# EAGLE design BBRF103-RC3 (EAGLE 8.4.3)
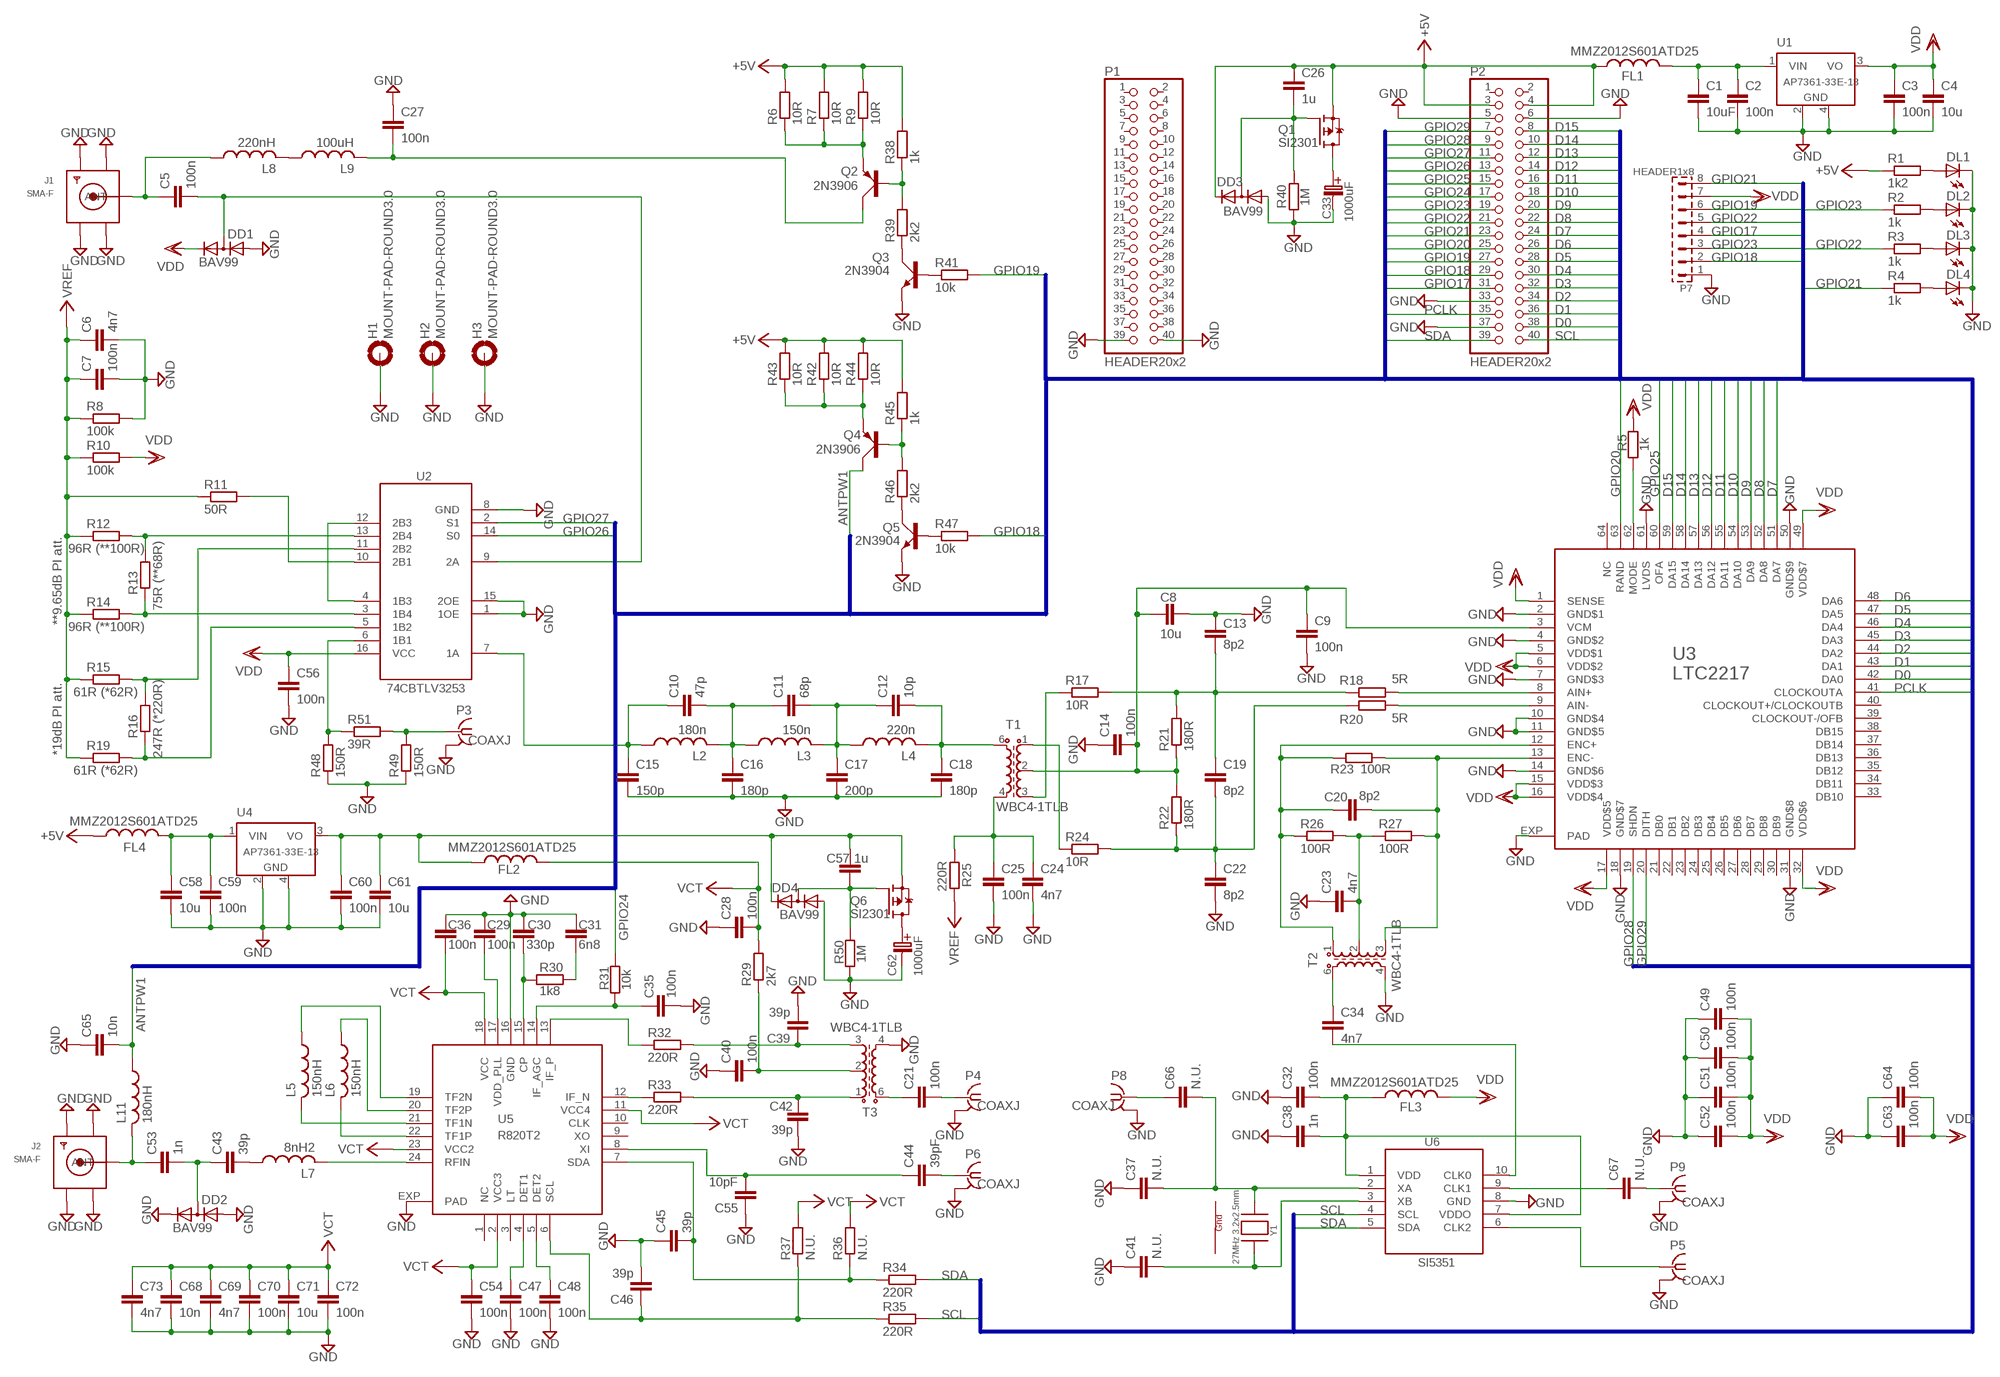
[diagram p0: schematic, sheet 1]

## Parts
C1  10uF  C-EUC0805K  [C0805K]
C2  100n  C-EUC0603K  [C0603K]
C3  100n  C-EUC0603K  [C0603K]
C4  10u  C-EUC0805K  [C0805K]
C5  100n  C-EUC0603K  [C0603K]
C6  4n7  C-EUC0603K  [C0603K]
C7  100n  C-EUC0603K  [C0603K]
C8  10u  C-EUC0603K  [C0603K]
C9  100n  C-EUC0603K  [C0603K]
C10  47p  C-EUC0603K  [C0603K]
C11  68p  C-EUC0603K  [C0603K]
C12  10p  C-EUC0603K  [C0603K]
C13  8p2  C-EUC0603K  [C0603K]
C14  100n  C-EUC0603K  [C0603K]
C15  150p  C-EUC0603K  [C0603K]
C16  180p  C-EUC0603K  [C0603K]
C17  200p  C-EUC0603K  [C0603K]
C18  180p  C-EUC0603K  [C0603K]
C19  8p2  C-EUC0603K  [C0603K]
C20  8p2  C-EUC0603K  [C0603K]
C21  100n  C-EUC0603K  [C0603K]
C22  8p2  C-EUC0603K  [C0603K]
C23  4n7  C-EUC0603K  [C0603K]
C24  4n7  C-EUC0603K  [C0603K]
C25  100n  C-EUC0603K  [C0603K]
C26  1u  C-EUC0603K  [C0603K]
C27  100n  C-EUC0603K  [C0603K]
C28  100n  C-EUC0603K  [C0603K]
C29  100n  C-EUC0603K  [C0603K]
C30  330p  C-EUC0603K  [C0603K]
C31  6n8  C-EUC0603K  [C0603K]
C32  100n  C-EUC0603K  [C0603K]
C33  1000uF  #_RADIAL_POUZDRA5  [C_EL_5]
C34  4n7  C-EUC0603K  [C0603K]
C35  100n  C-EUC0603K  [C0603K]
C36  100n  C-EUC0603K  [C0603K]
C37  N.U.  C-EUC0603K  [C0603K]
C38  1n  C-EUC0603K  [C0603K]
C39  39p  C-EUC0603K  [C0603K]
C40  100n  C-EUC0603K  [C0603K]
C41  N.U.  C-EUC0603K  [C0603K]
C42  39p  C-EUC0603K  [C0603K]
C43  39p  C-EUC0603K  [C0603K]
C44  39pF  C-EUC0603K  [C0603K]
C45  39p  C-EUC0603K  [C0603K]
C46  39p  C-EUC0603K  [C0603K]
C47  100n  C-EUC0603K  [C0603K]
C48  100n  C-EUC0603K  [C0603K]
C49  100n  C-EUC0603K  [C0603K]
C50  100n  C-EUC0603K  [C0603K]
C51  100n  C-EUC0603K  [C0603K]
C52  100n  C-EUC0603K  [C0603K]
C53  1n  C-EUC0603K  [C0603K]
C54  100n  C-EUC0603K  [C0603K]
C55  10pF  C-EUC0603K  [C0603K]
C56  100n  C-EUC0603K  [C0603K]
C57  1u  C-EUC0603K  [C0603K]
C58  10u  C-EUC0805K  [C0805K]
C59  100n  C-EUC0603K  [C0603K]
C60  100n  C-EUC0603K  [C0603K]
C61  10u  C-EUC0805K  [C0805K]
C62  1000uF  #_RADIAL_POUZDRA5  [C_EL_5]
C63  100n  C-EUC0603K  [C0603K]
C64  100n  C-EUC0603K  [C0603K]
C65  10n  C-EUC0603K  [C0603K]
C66  N.U.  C-EUC0603K  [C0603K]
C67  N.U.  C-EUC0603K  [C0603K]
C68  10n  C-EUC0603K  [C0603K]
C69  4n7  C-EUC0603K  [C0603K]
C70  100n  C-EUC0603K  [C0603K]
C71  10u  C-EUC0805K  [C0805K]
C72  100n  C-EUC0603K  [C0603K]
C73  4n7  C-EUC0603K  [C0603K]
DD1  BAV99  BAV199  [SOT23]
DD2  BAV99  BAV199  [SOT23]
DD3  BAV99  BAV199  [SOT23]
DD4  BAV99  BAV199  [SOT23]
DL1  LEDCHIPLED_0805  [CHIPLED_0805]
DL2  LEDCHIPLED_0805  [CHIPLED_0805]
DL3  LEDCHIPLED_0805  [CHIPLED_0805]
DL4  LEDCHIPLED_0805  [CHIPLED_0805]
FL1  MMZ2012S601ATD25  L-USL2012C  [L2012C]
FL2  MMZ2012S601ATD25  L-USL2012C  [L2012C]
FL3  MMZ2012S601ATD25  L-USL2012C  [L2012C]
FL4  MMZ2012S601ATD25  L-USL2012C  [L2012C]
H1  MOUNT-PAD-ROUND3.0  [3,0-PAD]
H2  MOUNT-PAD-ROUND3.0  [3,0-PAD]
H3  MOUNT-PAD-ROUND3.0  [3,0-PAD]
J1  SMA-F  SMACONNECTOR_EDGE  [SMA_EDGELAUNCH]
J2  SMA-F  SMACONNECTOR_EDGE  [SMA_EDGELAUNCH]
L2  180n  L-USL2012C  [L2012C]
L3  150n  L-USL2012C  [L2012C]
L4  220n  L-USL2012C  [L2012C]
L5  150nH  L-0603  [C0603K]
L6  150nH  L-0603  [C0603K]
L7  8nH2  L-0603  [C0603K]
L8  220nH  L-USL2012C  [L2012C]
L9  100uH  L-USL2012C  [L2012C]
L11  180nH  L-0603  [C0603K]
P1  HEADER20x2  PINHD-2X20  [2X20]
P2  HEADER20x2  PINHD-2X20  [2X20]
P3  COAXJ  [COAXJ]
P4  COAXJ  [COAXJ]
P5  COAXJ  [COAXJ]
P6  COAXJ  [COAXJ]
P7  HEADER1x8  S1G8_JUMP  [S1G8_JUM]
P8  COAXJ  [COAXJ]
P9  COAXJ  [COAXJ]
Q1  SI2301  [SOT23]
Q2  2N3906  [SOT23W_INFINEON]
Q3  2N3904  [SOT23W_INFINEON]
Q4  2N3906  [SOT23W_INFINEON]
Q5  2N3904  [SOT23W_INFINEON]
Q6  SI2301  [SOT23]
R1  1k2  R-EU_R0603  [R0603]
R2  1k  R-EU_R0603  [R0603]
R3  1k  R-EU_R0603  [R0603]
R4  1k  R-EU_R0603  [R0603]
R5  1k  R-EU_R0603  [R0603]
R6  10R  R-EU_R0603  [R0603]
R7  10R  R-EU_R0603  [R0603]
R8  100k  R-EU_R0603  [R0603]
R9  10R  R-EU_R0603  [R0603]
R10  100k  R-EU_R0603  [R0603]
R11  50R  R-EU_R0603  [R0603]
R12  96R (**100R)  R-EU_R0603  [R0603]
R13  75R (**68R)  R-EU_R0603  [R0603]
R14  96R (**100R)  R-EU_R0603  [R0603]
R15  61R (*62R)  R-EU_R0603  [R0603]
R16  247R (*220R)  R-EU_R0603  [R0603]
R17  10R  R-EU_R0603  [R0603]
R18  5R  R-EU_R0603  [R0603]
R19  61R (*62R)  R-EU_R0603  [R0603]
R20  5R  R-EU_R0603  [R0603]
R21  180R  R-EU_R0603  [R0603]
R22  180R  R-EU_R0603  [R0603]
R23  100R  R-EU_R0603  [R0603]
R24  10R  R-EU_R0603  [R0603]
R25  220R  R-EU_R0603  [R0603]
R26  100R  R-EU_R0603  [R0603]
R27  100R  R-EU_R0603  [R0603]
R29  2k7  R-EU_R0603  [R0603]
R30  1k8  R-EU_R0603  [R0603]
R31  10k  R-EU_R0603  [R0603]
R32  220R  R-EU_R0603  [R0603]
R33  220R  R-EU_R0603  [R0603]
R34  220R  R-EU_R0603  [R0603]
R35  220R  R-EU_R0603  [R0603]
R36  N.U.  R-EU_R0603  [R0603]
R37  N.U.  R-EU_R0603  [R0603]
R38  1k  R-EU_R0603  [R0603]
R39  2k2  R-EU_R0603  [R0603]
R40  1M  R-EU_R0603  [R0603]
R41  10k  R-EU_R0603  [R0603]
R42  10R  R-EU_R0603  [R0603]
R43  10R  R-EU_R0603  [R0603]
R44  10R  R-EU_R0603  [R0603]
R45  1k  R-EU_R0603  [R0603]
R46  2k2  R-EU_R0603  [R0603]
R47  10k  R-EU_R0603  [R0603]
R48  150R  R-EU_R0603  [R0603]
R49  150R  R-EU_R0603  [R0603]
R50  1M  R-EU_R0603  [R0603]
R51  39R  R-EU_R0603  [R0603]
T1  WBC4-1TLB  WBC4-1WL  [WBC4-1WL]
T2  WBC4-1TLB  WBC4-1WL  [WBC4-1WL]
T3  WBC4-1TLB  WBC4-1WL  [WBC4-1WL]
U1  AP7361-33E-13  [SOT223]
U2  74CBTLV3253  [TSSOP16]
U3  LTC2217  [QFN64-9X9]
U4  AP7361-33E-13  [SOT223]
U5  R820T2  R820T  [QFN24]
U6  SI5351  [MSOP10]
Y1  27MHz 3.2x2.5mm  XTAL-4-3225  [NX3225]

## Nets
+5V: C26.1 DD3.2(C) FL1.1 FL4.1 P2.3 P2.4 Q1.2(S) R1.1 R6.2 R7.2 R9.2 R38.2 R42.2 R43.2 R44.2 R45.2
ANTPW1: C65.2 L11.1 Q4.3(C)
D0: P2.38 U3.42(DA0)
D1: P2.36 U3.43(DA1)
D2: P2.34 U3.44(DA2)
D3: P2.32 U3.45(DA3)
D4: P2.30 U3.46(DA4)
D5: P2.28 U3.47(DA5)
D6: P2.26 U3.48(DA6)
D7: P2.24 U3.51(DA7)
D8: P2.22 U3.52(DA8)
D9: P2.20 U3.53(DA9)
D10: P2.18 U3.54(DA10)
D11: P2.16 U3.55(DA11)
D12: P2.14 U3.56(DA12)
D13: P2.12 U3.57(DA13)
D14: P2.10 U3.58(DA14)
D15: P2.8 U3.59(DA15)
GND: C1.2 C2.2 C3.2 C4.2 C6.2 C7.2 C8.2 C9.2 C13.1 C14.1 C15.2 C16.2 C17.2 C18.2 C22.2 C23.1 C24.2 C25.2 C27.1 C28.1 C29.1 C30.1 C31.1 C32.1 C33.C-(C_EL-) C35.2 C36.1 C37.1 C38.1 C39.2 C40.1 C41.1 C42.1 C45.1 C46.2 C47.2 C48.2 C49.1 C50.1 C51.1 C52.1 C54.2 C55.1 C56.2 C58.2 C59.2 C60.2 C61.2 C62.C-(C_EL-) C63.1 C64.1 C65.1 C68.2 C69.2 C70.2 C71.2 C72.2 C73.2 DD1.1(A) DD2.1(A) DD2.2(C) DD3.1(A) DD4.1(A) DL1.C DL2.C DL3.C DL4.C H1.B3,0(MOUNT) H2.B3,0(MOUNT) H3.B3,0(MOUNT) J1.GND@1(GND4) J1.GND@2(GND3) J1.GND@3(GND2) J1.GND@4(GND1) J2.GND@1(GND4) J2.GND@2(GND3) J2.GND@3(GND2) J2.GND@4(GND1) P1.39 P1.40 P2.5 P2.6 P2.33 P2.37 P3.2(GND) P4.2(GND) P5.2(GND) P6.2(GND) P7.1 P8.2(GND) P9.2(GND) Q3.2(E) Q5.2(E) R8.2 R40.1 R48.1 R49.1 R50.1 T2.4 T3.4 U1.2(GND) U1.4(GND) U2.1(1OE) U2.8(GND) U2.15(2OE) U3.2(GND$1) U3.4(GND$2) U3.7(GND$3) U3.10(GND$4) U3.11(GND$5) U3.14(GND$6) U3.18(GND$7) U3.31(GND$8) U3.50(GND$9) U3.61(LVDS) U3.EXP(PAD) U4.2(GND) U4.4(GND) U5.16(GND) U5.EXP(PAD) U6.8(GND)
GPIO17: P2.31 P7.4
GPIO18: P2.29 P7.2 R47.2
GPIO19: P2.27 P7.6 R41.2
GPIO20: P2.25 U3.63(RAND)
GPIO21: P2.23 P7.8 R4.1
GPIO22: P2.21 P7.5 R3.1
GPIO23: P2.19 P7.3 R2.1
GPIO24: P2.17 R31.2
GPIO25: P2.15 U3.60(OFA)
GPIO26: P2.13 U2.14(S0)
GPIO27: P2.11 U2.2(S1)
GPIO28: P2.9 U3.19(SHDN)
GPIO29: P2.7 U3.20(DITH)
N$1: DL1.A R1.2
N$2: C33.C+(C_EL+) Q1.3(D)
N$3: C26.2 DD3.3(AC) Q1.1(G) R40.2
N$4: DL2.A R2.2
N$5: DL3.A R3.2
N$6: DL4.A R4.2
N$7: R5.1 U3.62(MODE)
N$8: C20.2 R23.2 R27.2 T2.3 U3.13(ENC-)
N$9: C1.1 C2.1 FL1.2 U1.1(VIN)
N$10: C23.2 R26.2 R27.1 T2.2
N$11: C20.1 R23.1 R26.1 T2.1 U3.12(ENC+)
N$12: C34.1 T2.6
N$13: C34.2 U6.10(CLK0)
N$14: C37.2 C66.2 U6.2(XA) Y1.1(X1)
N$15: C67.2 P9.1
N$16: C66.1 P8.1
N$17: C32.2 C38.2 FL3.1 U6.1(VDD) U6.7(VDDO)
N$18: C67.1 U6.9(CLK1)
N$19: P5.1 U6.6(CLK2)
N$20: R20.2 U3.9(AIN-)
N$21: R18.2 U3.8(AIN+)
N$22: C41.2 U6.3(XB) Y1.3(X2)
N$23: C13.2 C19.1 R17.2 R18.1 R21.2
N$24: C8.1 C9.1 C14.2 R21.1 R22.2 T1.2 U3.3(VCM)
N$25: C19.2 C22.1 R20.1 R22.1 R24.2
N$26: R24.1 T1.1
N$27: R17.1 T1.3
N$28: C24.1 C25.1 R25.1 T1.4
N$29: C12.2 C18.1 L4.2 T1.6
N$30: C11.2 C12.1 C17.1 L3.2 L4.1
N$32: C10.2 C11.1 C16.1 L2.2 L3.1
N$34: C10.1 C15.1 L2.1 U2.7(1A)
N$35: C62.C+(C_EL+) Q6.3(D)
N$36: Q3.1(B) R41.1
N$37: Q3.3(C) R39.1
N$38: Q2.1(B) R38.1 R39.2
N$39: C58.1 C59.1 FL4.2 U4.1(VIN)
N$40: C57.2 DD4.3(AC) Q6.1(G) R50.2
N$41: Q2.2(E) R6.1 R7.1 R9.1
N$42: C48.1 U5.5(DET2)
N$43: C45.2 R34.1 R36.1 U5.7(SDA)
N$44: Q5.1(B) R47.1
N$45: Q5.3(C) R46.1
N$46: Q4.1(B) R45.1 R46.2
N$47: Q4.2(E) R42.1 R43.1 R44.1
N$48: C47.1 U5.4(DET1)
N$49: C21.1 T3.6
N$50: C21.2 P4.1
N$51: C42.2 R33.2 T3.1
N$52: C39.1 R32.2 T3.3
N$53: C40.2 R29.1 T3.2
N$54: R48.2 R51.1 U2.6(1B1)
N$55: R33.1 U5.12(IF_N)
N$56: C44.2 P6.1
N$57: C44.1 C55.2 U5.8(XI)
N$58: C46.1 R35.1 R37.1 U5.6(SCL)
N$59: P3.1 R49.2 R51.2
N$60: R32.1 U5.13(IF_P)
N$61: C35.1 R31.1 U5.14(IF_AGC)
N$62: C30.2 R30.1 U5.15(CP)
N$63: C31.2 R30.2
N$64: C27.2 L9.2 Q2.3(C)
N$65: C29.2 U5.17(VDD_PLL)
N$66: C5.2 DD1.3(AC) U2.9(2A)
N$68: L8.2 L9.1
N$69: L6.2 U5.22(TF1P)
N$70: L6.1 U5.20(TF2P)
N$71: L5.2 U5.21(TF1N)
N$72: L5.1 U5.19(TF2N)
N$73: L7.2 U5.24(RFIN)
N$74: C43.2 L7.1
N$75: C43.1 C53.2 DD2.3(AC)
N$76: C5.1 J1.P(ANT) L8.1
N$78: C53.1 J2.P(ANT) L11.2
N$79: R12.2 R13.2 U2.13(2B4)
N$80: C57.1 C60.1 C61.1 DD4.2(C) FL2.1 Q6.2(S) U4.3(VO)
N$81: R13.1 R14.2 U2.3(1B4)
N$82: R15.2 R16.2 U2.11(2B2)
N$83: R16.1 R19.2 U2.5(1B2)
N$84: U2.4(1B3) U2.12(2B3)
N$85: R11.2 U2.10(2B1)
PCLK: P2.35 U3.41(CLOCKOUTA)
SCL: P2.40 R35.2 U6.4(SCL)
SDA: P2.39 R34.2 U6.5(SDA)
VCT: C28.2 C36.2 C54.1 C68.1 C69.1 C70.1 C71.1 C72.1 C73.1 FL2.2 R29.2 R36.2 R37.2 U5.2(VCC3) U5.11(VCC4) U5.18(VCC) U5.23(VCC2)
VDD: C3.1 C4.1 C49.2 C50.2 C51.2 C52.2 C56.1 C63.2 C64.2 DD1.2(C) FL3.2 P7.7 R5.2 R10.2 U1.3(VO) U2.16(VCC) U3.1(SENSE) U3.5(VDD$1) U3.6(VDD$2) U3.15(VDD$3) U3.16(VDD$4) U3.17(VDD$5) U3.32(VDD$6) U3.49(VDD$7)
VREF: C6.1 C7.1 R8.1 R10.1 R11.1 R12.1 R14.1 R15.1 R19.1 R25.2
Unconnected: P1.1 P1.2 P1.3 P1.4 P1.5 P1.6 P1.7 P1.8 P1.9 P1.10 P1.11 P1.12 P1.13 P1.14 P1.15 P1.16 P1.17 P1.18 P1.19 P1.20 P1.21 P1.22 P1.23 P1.24 P1.25 P1.26 P1.27 P1.28 P1.29 P1.30 P1.31 P1.32 P1.33 P1.34 P1.35 P1.36 P1.37 P1.38 P2.1 P2.2 U3.21(DB0) U3.22(DB1) U3.23(DB2) U3.24(DB3) U3.25(DB4) U3.26(DB5) U3.27(DB6) U3.28(DB7) U3.29(DB8) U3.30(DB9) U3.33(DB10) U3.34(DB11) U3.35(DB12) U3.36(DB13) U3.37(DB14) U3.38(DB15) U3.39(CLOCKOUT-/OFB) U3.40(CLOCKOUT+/CLOCKOUTB) U3.64(NC) U5.1(NC) U5.3(LT) U5.9(XO) U5.10(CLK)

## Buses
GPIO[17..29],PCLK,D[0..15],SDA,SCL,ANTPW1

## Notes on the sheet
- **9.65dB PI att.
- *19dB PI att.

## Power pins joined to a net without a drawn wire
G1: Y1.4(G1)
G2: Y1.2(G2)

## Library data of the parts
C1-C32 C34-C61 C63-C73 = rcl:C-EU: CAPACITOR, European symbol
C33 C62 = #PaJa_C-el_2:#_RADIAL_POUZDRA
DD1-DD4 = diode:BAV199: DIODE low-leakage double diode
DL1-DL4 = adafruit:LED: LED OSRAM: - CHIPLED LG R971, LG N971, LY N971, LG Q971, LY Q971, LO R971, LY R971 LH N974, LH R974 LS Q976, LO Q976, LY Q976 LO Q996 - Hyper CHIPLED LW Q18S LB Q993, LB Q99A, LB R99A - SideLED LS A670, LO A670, LY A670, LG A670, LP A670 LB A673, LV A673, LT A673, LW A673 LH A674 LY A675 LS A676, LA A676, LO A676, LY A676, LW A676 LS A679, LY A679, LG A679 - Hyper Micro SIDELED® LS Y876, LA Y876, LO Y876, LY Y876 LT Y87S - SmartLED LW L88C, LW L88S LB L89C, LB L89S, LG L890 LS L89K, LO L89K, LY L89K LS L896, LA L896, LO L896, LY L896 - TOPLED LS T670, LO T670, LY T670, LG T670, LP T670 LSG T670, LSP T670, LSY T670, LOP T670, LYG T670 LG T671, LOG T671, LSG T671 LB T673, LV T673, LT T673, LW T673 LH T674 LS T676, LA T676, LO T676, LY T676, LB T676, LH T676, LSB T676, LW T676 LB T67C, LV T67C, LT T67C, LS T67K, LO T67K, LY T67K, LW E67C LS E67B, LA E67B, LO E67B, LY E67B, LB E67C, LV E67C, LT E67C LW T67C LS T679, LY T679, LG T679 LS T770, LO T770, LY T770, LG T770, LP T770 LB T773, LV T773, LT T773, LW T773 LH T774 LS E675, LA E675, LY E675, LS T675 LS T776, LA T776, LO T776, LY T776, LB T776 LHGB T686 LT T68C, LB T68C - Hyper Mini TOPLED® LB M676 - Mini TOPLED Santana® LG M470 LS M47K, LO M47K, LY M47K Source: http://www.osram.convergy.de/
FL1-FL4 L2-L4 L8 L9 = rcl:L-US: INDUCTOR, American symbol
H1-H3 = holes:MOUNT-PAD-ROUND: MOUNTING PAD, round
J1 J2 = adafruit:SMACONNECTOR: SMA Connector 90° DIP SMA Connector, 50 Ohm (4UConnector: 07259)
L5-L7 L11 = rcl:L-0603
P1 P2 = adafruit:PINHD-2X20: PIN HEADER
P3-P6 P8 P9 = con-coax:COAXJ; OC_FARNELL: unknown; OC_NEWARK: unknown
P7 = #PaJa_konektory:S1G8_JUMP: Radove konektory - koliky - 8x
Q1 Q6 = transistor-fet:SI2301
Q2 Q4 = transistor-small-signal:2N3906: PNP TRANSISTOR
Q3 Q5 = transistor-small-signal:2N3904: NPN TRANSISTOR
R1-R27 R29-R51 = rcl:R-EU_: RESISTOR, European symbol
T1-T3 = inductor-neosid:WBC4-1WL
U1 U4 = national-semiconductor:AP7361-33E-13
U2 = analog-devices:74CBTLV3253
U3 = gennum:LTC2217
U5 = microwave:R820T
U6 = analog-devices:SI5351
Y1 = adafruit:XTAL-4: Classic 4-pin 3.2 x 2.5mm crystal

## Board
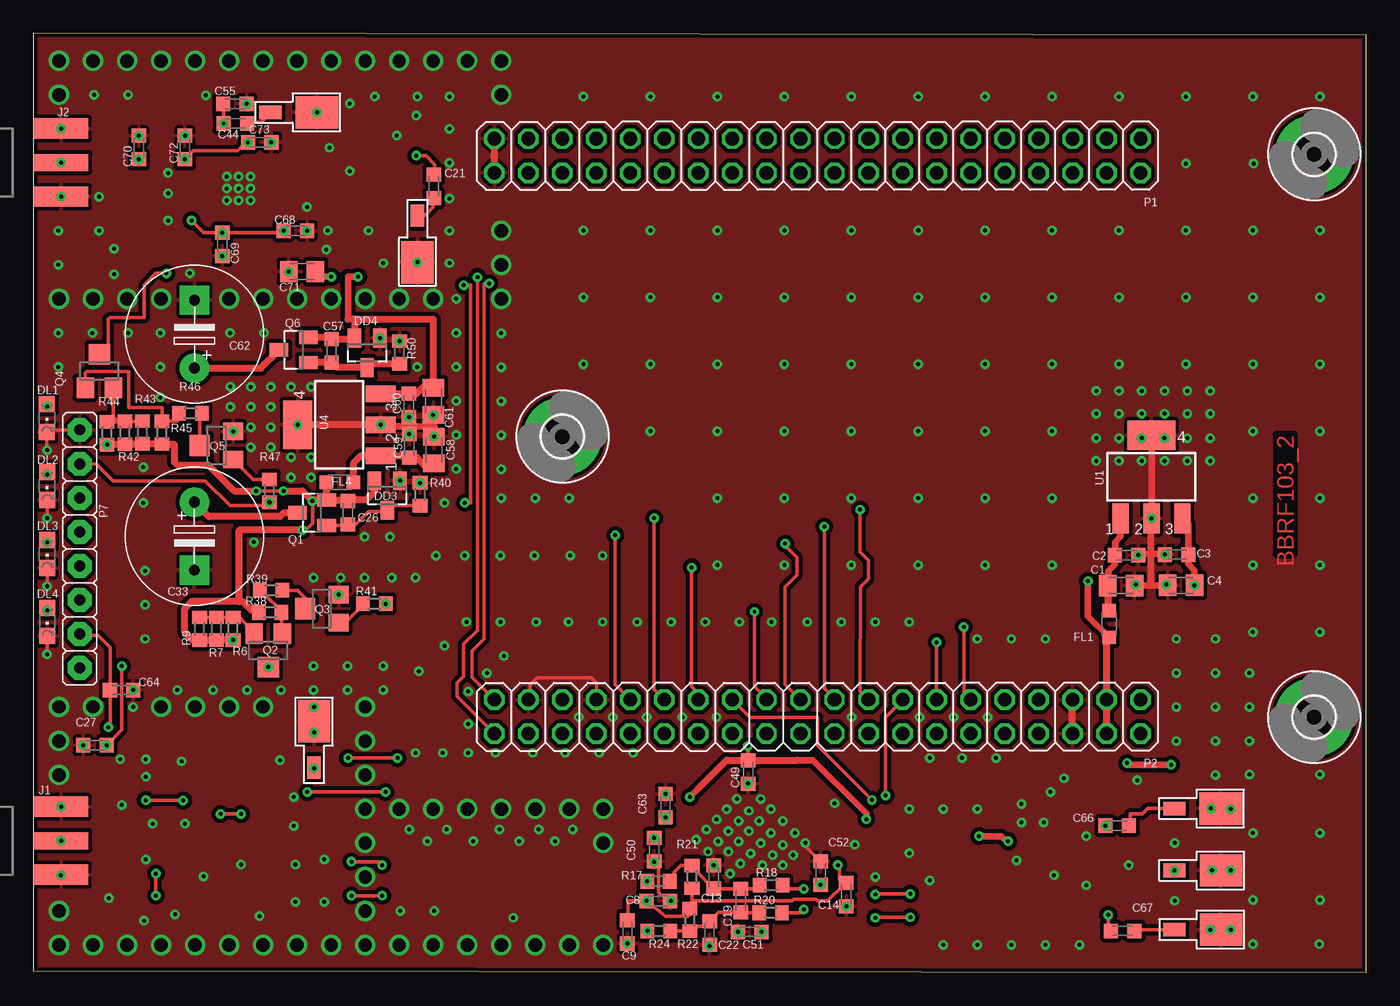
[diagram p1: board, top side]
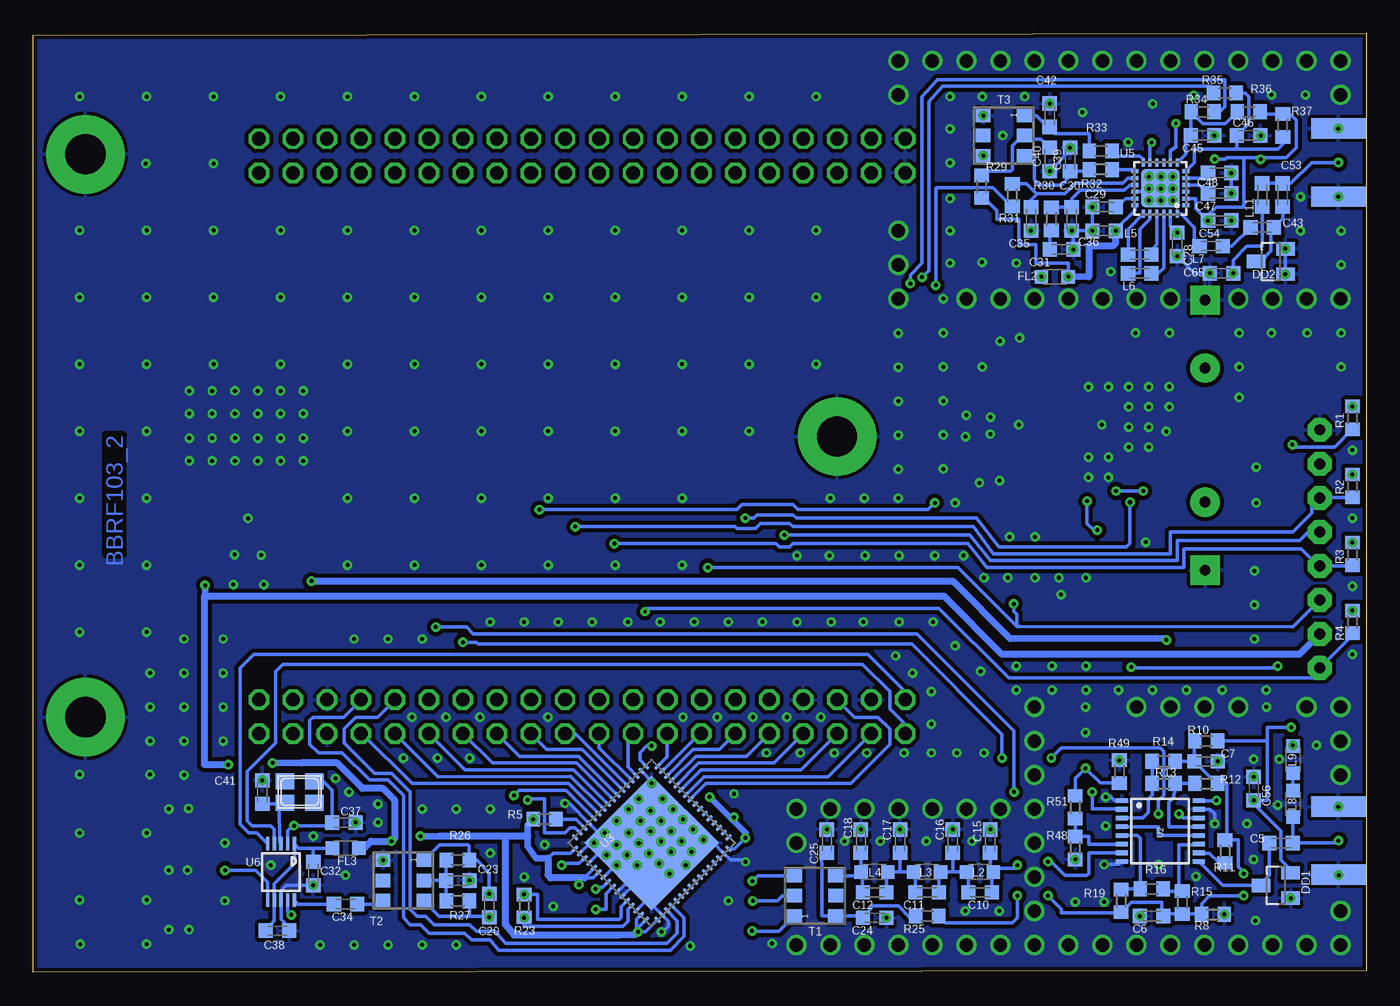
[diagram p2: board, bottom side, seen from below]

Size 99.51 x 70.11 mm. Coordinates in mm from the lower left corner, seen from the top.
Outline: 0,0.13 99.51,0 99.51,69.98 0,70.11 0,0.13
Copper layers (1*16): Top 0.035mm / dielectric 1.5mm / Bottom 0.035mm
Design rules "default *": minimum track width 6mil, minimum drill 0.35mm, track to track 6mil, track to pad 6mil, pad to pad 6mil, via to via 6mil, smd to smd 6mil, copper to edge 5mil, drill to drill 6mil, minimum pad ring 10mil, minimum via ring 8mil, stop-mask expansion 4mil, vias tented up to drill 0mil, thermal gap 10mil

### Footprints (pad centres in the part's own frame; a part is rotated, then mirrored left to right if it is on the bottom)
C0805K = smd 1.3 x 1.6: 1 -1,0; 2 1,0
C0603K = smd 1.05 x 1.08: 1 -0.875,0; 2 0.875,0
C_EL_5 = drill 0.813 pad 2.184: C+ -2.54,0 | drill 0.813 pad 2.184 square: C- 2.54,0
SOT23 = smd 1 x 1.4: 1 -0.95,-1.1; 2 0.95,-1.1; 3 0,1.1
CHIPLED_0805 = smd 1.2 x 1.2: A 0,-1.05; C 0,1.05
L2012C = smd 1 x 1: 1 -1,0; 2 1,0
3,0-PAD = drill 3 pad 5.842: B3,0 0,0
SMA_EDGELAUNCH = smd 4.064 x 1.524: GND@1 2.032,-2.54; GND@2 2.032,2.54 | smd 4.064 x 1.524 bottom: GND@3 2.032,2.54; GND@4 2.032,-2.54 | smd 4.064 x 1.27: P 2.032,0
2X20 = drill 1.016 octagon: 1 -24.13,-1.27; 2 -24.13,1.27; 3 -21.59,-1.27; 4 -21.59,1.27; 5 -19.05,-1.27; 6 -19.05,1.27; 7 -16.51,-1.27; 8 -16.51,1.27; 9 -13.97,-1.27; 10 -13.97,1.27; 11 -11.43,-1.27; 12 -11.43,1.27; 13 -8.89,-1.27; 14 -8.89,1.27; 15 -6.35,-1.27; 16 -6.35,1.27; 17 -3.81,-1.27; 18 -3.81,1.27; 19 -1.27,-1.27; 20 -1.27,1.27; 21 1.27,-1.27; 22 1.27,1.27; 23 3.81,-1.27; 24 3.81,1.27; 25 6.35,-1.27; 26 6.35,1.27; 27 8.89,-1.27; 28 8.89,1.27; 29 11.43,-1.27; 30 11.43,1.27; 31 13.97,-1.27; 32 13.97,1.27; 33 16.51,-1.27; 34 16.51,1.27; 35 19.05,-1.27; 36 19.05,1.27; 37 21.59,-1.27; 38 21.59,1.27; 39 24.13,-1.27; 40 24.13,1.27
COAXJ = smd 1.651 x 1.016: 1 -6.223,0.004 | smd 3.175 x 2.413: 2 -2.745,0
S1G8_JUM = drill 0.813 pad 1.778 octagon: 1 -8.89,0; 2 -6.35,0; 3 -3.81,0; 4 -1.27,0; 5 1.27,0; 6 3.81,0; 7 6.35,0; 8 8.89,0
SOT23W_INFINEON = smd 1.5 x 1.3: 1 -1.25,1.05; 2 -1.25,-1.05 | smd 1.5 x 1.6: 3 1.25,0
R0603 = smd 1 x 1.1: 1 -0.85,0; 2 0.85,0
WBC4-1WL = smd 1 x 1.1: 1 -1.5,1.534; 2 0,1.534; 3 1.5,1.534; 4 -1.497,-1.534; 5 0,-1.539; 6 1.497,-1.534
SOT223 = smd 1.219 x 2.235: 1 -2.311,-3.099; 2 0,-3.099; 3 2.311,-3.099 | smd 3.6 x 2.2: 4 0,3.099
TSSOP16 = smd 0.9 x 0.35: 1 -2.875,2.275; 2 -2.875,1.625; 3 -2.875,0.975; 4 -2.875,0.325; 5 -2.875,-0.325; 6 -2.875,-0.975; 7 -2.875,-1.625; 8 -2.875,-2.275; 9 2.875,-2.275; 10 2.875,-1.625; 11 2.875,-0.975; 12 2.875,-0.325; 13 2.875,0.325; 14 2.875,0.975; 15 2.875,1.625; 16 2.875,2.275
QFN64-9X9 = smd 0.55 x 0.25: 1 -4.35,3.75; 2 -4.35,3.25; 3 -4.35,2.75; 4 -4.35,2.25; 5 -4.35,1.75; 6 -4.35,1.25; 7 -4.35,0.75; 8 -4.35,0.25; 9 -4.35,-0.25; 10 -4.35,-0.75; 11 -4.35,-1.25; 12 -4.35,-1.75; 13 -4.35,-2.25; 14 -4.35,-2.75; 15 -4.35,-3.25; 16 -4.35,-3.75; 33 4.35,-3.75; 34 4.35,-3.25; 35 4.35,-2.75; 36 4.35,-2.25; 37 4.35,-1.75; 38 4.35,-1.25; 39 4.35,-0.75; 40 4.35,-0.25; 41 4.35,0.25; 42 4.35,0.75; 43 4.35,1.25; 44 4.35,1.75; 45 4.35,2.25; 46 4.35,2.75; 47 4.35,3.25; 48 4.35,3.75 | smd 0.25 x 0.55: 17 -3.75,-4.35; 18 -3.25,-4.35; 19 -2.75,-4.35; 20 -2.25,-4.35; 21 -1.75,-4.35; 22 -1.25,-4.35; 23 -0.75,-4.35; 24 -0.25,-4.35; 25 0.25,-4.35; 26 0.75,-4.35; 27 1.25,-4.35; 28 1.75,-4.35; 29 2.25,-4.35; 30 2.75,-4.35; 31 3.25,-4.35; 32 3.75,-4.35; 49 3.75,4.35; 50 3.25,4.35; 51 2.75,4.35; 52 2.25,4.35; 53 1.75,4.35; 54 1.25,4.35; 55 0.75,4.35; 56 0.25,4.35; 57 -0.25,4.35; 58 -0.75,4.35; 59 -1.25,4.35; 60 -1.75,4.35; 61 -2.25,4.35; 62 -2.75,4.35; 63 -3.25,4.35; 64 -3.75,4.35 | smd 7.1 x 7.1: EXP 0,0
QFN24 = smd 0.6 x 0.3: 1 -1.905,1.27; 2 -1.905,0.762; 3 -1.905,0.254; 4 -1.905,-0.254; 5 -1.905,-0.762; 6 -1.905,-1.27; 13 1.905,-1.27; 14 1.905,-0.762; 15 1.905,-0.254; 16 1.905,0.254; 17 1.905,0.762; 18 1.905,1.27 | smd 0.3 x 0.6: 7 -1.27,-1.905; 8 -0.762,-1.905; 9 -0.254,-1.905; 10 0.254,-1.905; 11 0.762,-1.905; 12 1.27,-1.905; 19 1.27,1.905; 20 0.762,1.905; 21 0.254,1.905; 22 -0.254,1.905; 23 -0.762,1.905; 24 -1.27,1.905 | smd 2.9 x 2.9: EXP 0,0
MSOP10 = smd 0.25 x 1: 1 -1,-2.113; 2 -0.5,-2.113; 3 0,-2.113; 4 0.5,-2.113; 5 1,-2.113; 6 1,2.113; 7 0.5,2.113; 8 0,2.113; 9 -0.5,2.113; 10 -1,2.113
NX3225 = smd 1.4 x 1.2: 1 -1.1,-0.8; 2 1.1,-0.8; 3 1.1,0.8; 4 -1.1,0.8

### Placement (x,y rotation side)
C1  81.22,28.87 0 top
C2  81.63,31.16 0 top
C3  85.36,31.2 180 top
C4  85.7,28.89 180 top
C5  6.35,9.65 180 bottom
C6  16,4.19 180 bottom
C7  11.94,15.75 0 bottom
C8  46.67,5.32 0 top
C9  44.36,3.02 270 top
C10  28.83,5.97 180 bottom
C11  32.77,5.97 180 bottom
C12  36.7,5.97 180 bottom
C13  50.8,7.12 270 top
C14  60.7,5.8 90 top
C15  28.07,9.78 90 bottom
C16  30.86,9.78 90 bottom
C17  34.8,9.78 90 bottom
C18  37.72,9.78 90 bottom
C19  52.8,5.34 270 top
C20  65.48,4.98 270 bottom
C21  29.9,58.68 270 top
C22  50.48,2.94 270 top
C23  67.82,6.86 180 bottom
C24  36.7,4.06 0 bottom
C25  40.26,9.78 90 bottom
C26  23.48,34.3 270 top
C27  4.59,16.95 0 top
C28  14.1,54.36 90 bottom
C29  19.56,57.15 0 bottom
C30  21.97,56.26 90 bottom
C31  22.73,53.97 180 bottom
C32  78.61,7.37 90 bottom
C33  12.02,32.56 270 top
C34  76.2,5.08 180 bottom
C35  25.02,56.26 270 bottom
C36  19.56,55.37 0 bottom
C37  76.33,11.18 180 bottom
C38  81.28,3.1 180 bottom
C39  22.1,60.71 90 bottom
C40  23.62,60.71 90 bottom
C41  82.42,13.46 270 bottom
C42  23.62,64.01 270 bottom
C43  7.75,55.63 180 bottom
C44  15.08,63.39 0 top
C45  12.19,62.48 180 bottom
C46  8.76,62.48 0 bottom
C47  10.92,58.17 0 bottom
C48  10.92,59.69 0 bottom
C49  53.37,14.95 90 top
C50  46.35,9.15 90 top
C51  53.49,3.02 0 top
C52  58.78,7.41 270 top
C53  6.22,58.04 270 bottom
C54  10.92,56.13 0 bottom
C55  15.05,64.85 180 top
C56  8.38,13.72 90 bottom
C57  22.27,46.41 270 top
C58  29.91,39 90 top
C59  28.06,39.32 90 top
C60  28.04,42.34 270 top
C61  29.88,42.63 270 top
C62  12.02,47.66 90 top
C63  47.2,12.45 270 top
C64  6.59,21.08 180 top
C65  10.79,52.2 0 bottom
C66  80.92,10.94 180 top
C67  81.33,3.09 0 top
C68  19.56,55.37 0 top
C69  14.1,54.36 270 top
C70  7.87,61.59 90 top
C71  20.07,52.32 180 top
C72  11.3,61.59 90 top
C73  16.89,61.98 0 top
DD1  6.73,6.48 90 bottom
DD2  7.11,53.09 90 bottom
DD3  26.42,35.61 180 top
DD4  24.92,46.26 180 top
DL1  1,41.39 180 top
DL2  1.01,36.31 180 top
DL3  1.02,31.24 180 top
DL4  1.02,26.17 180 top
FL1  80.32,26 90 top
FL2  23.24,51.94 0 bottom
FL3  76.2,9.27 0 bottom
FL4  22.88,36.59 0 top
H1  39.5,40 0 top
H2  95.63,61.09 0 top
H3  95.63,19.05 0 top
J1  0.02,9.82 0 top
J2  0.02,60.46 0 top
L2  28.83,7.49 180 bottom
L3  32.77,7.49 180 bottom
L4  36.7,7.49 180 bottom
L5  16.89,53.59 0 bottom
L6  16.89,52.2 0 bottom
L7  11.56,54.23 180 bottom
L8  5.46,12.57 90 bottom
L9  5.46,15.88 90 bottom
L11  7.75,58.04 90 bottom
P1  58.54,60.98 180 top
P2  58.54,19.08 180 top
P3  20.95,21.5 90 top
P4  28.67,50.28 270 top
P5  91.42,7.61 0 top
P6  23.92,64.22 0 top
P7  3.44,31.62 270 top
P8  91.41,12.23 0 top
P9  91.42,3.18 0 top
Q1  20.8,34.32 90 top
Q2  17.53,24.04 270 top
Q3  21.53,27.15 180 top
Q4  4.92,44.9 90 top
Q5  13.67,39.34 180 top
Q6  19.43,46.48 90 top
R1  1.02,41.4 90 bottom
R2  1.02,36.32 90 bottom
R3  1.02,31.24 90 bottom
R4  1.02,26.16 90 bottom
R5  61.34,11.43 180 bottom
R6  14.91,25.65 270 top
R7  13.66,25.65 270 top
R8  11.43,4.32 0 bottom
R9  12.4,25.65 270 top
R10  11.94,17.27 0 bottom
R11  10.54,9.02 270 bottom
R12  11.94,14.1 180 bottom
R13  15.11,14.1 0 bottom
R14  15.11,15.75 180 bottom
R15  13.72,5.21 90 bottom
R16  16,6.22 0 bottom
R17  46.68,6.8 0 top
R18  55.09,6.51 0 top
R19  18.29,5.33 90 bottom
R20  55.05,4.44 0 top
R21  49.17,7.12 90 top
R22  49.01,3.92 90 top
R23  62.87,4.95 270 bottom
R24  46.69,3.08 0 top
R25  32.77,4.19 0 bottom
R26  67.82,8.38 180 bottom
R27  67.82,5.33 0 bottom
R29  28.7,58.67 270 bottom
R30  23.49,56.26 270 bottom
R31  26.42,58.04 270 bottom
R32  19.81,59.94 180 bottom
R33  19.81,61.34 180 bottom
R34  12.19,64.26 0 bottom
R35  10.54,65.66 180 bottom
R36  8.76,64.26 0 bottom
R37  6.22,63.25 90 bottom
R38  17.67,26.87 180 top
R39  17.75,28.52 180 top
R40  28.87,35.69 270 top
R41  25.45,27.52 0 top
R42  6.82,40.29 270 top
R43  8.14,40.32 270 top
R44  5.49,40.25 270 top
R45  9.6,40.3 270 top
R46  11.72,41.74 180 top
R47  17.62,35.95 270 top
R48  21.72,9.27 90 bottom
R49  18.41,14.99 270 bottom
R50  27.33,46.28 270 top
R51  21.72,12.32 90 bottom
T1  41.15,5.71 90 bottom
T2  71.88,6.86 270 bottom
T3  27.05,62.48 270 bottom
U1  83.49,37 0 top
U2  15.37,10.54 0 bottom
U3  53.34,9.65 45 bottom
U4  22.83,40.89 90 top
U5  15.37,58.55 180 bottom
U6  81.03,7.49 180 bottom
Y1  79.63,13.46 180 bottom

### Tracks (layer width: path | path; a pad name or v marks a point on that pad's centre or on a via)
+5V  (via drill 0.3)
  Top 0.254: 20.91,35.27 v20.83,35.18 20.83,33.53 20.32,33.02 v20.07,33.02 | 21.9,36.83 FL4.1 | 24.03,35.27 C26.1 | v16.64,35.94 v18.67,35.94
  Top 0.5: FL1.1 78.74,26.59 v78.74,29.21
  Top 0.508: FL1.1 80.13,25.07 P2.3 P2.4 | R6.2 R7.2 R9.2 11.91,24.8 11.3,25.4 11.3,27.18 11.81,27.69 15.37,27.69 | 15.37,27.69 15.62,27.69 16.26,27.05 16.77,27.05 R38.2 | R44.2 5.9,39.44 R42.2 7.36,39.47 R43.2 8.15,39.45 R45.2 9.65,39.39 10.52,39.39 10.54,39.37 10.54,38.1 10.79,37.85 13.08,37.85 14.99,35.94 v16.64,35.94 | 15.37,27.69 15.37,33.02 v20.07,33.02 | 21.99,35.18 Q1.2 | Q1.2 21.9,36.83 | Q1.2 23.65,35.27 C26.1 24.11,35.31 24.89,35.31 25.47,35.88 DD3.2 | Q1.2 20.91,35.27 | v18.67,35.94 20.07,35.94 v20.83,35.18
  Bottom 0.254: R1.1 2.33,39.24 5.33,39.24 R44.2 | v16.64,35.94 v18.67,35.94 | v20.83,35.18 20.83,33.53 20.32,33.02 v20.07,33.02
  Bottom 0.5: 26.58,24.93 15.04,24.93 R6.2
  Bottom 0.508: v78.74,29.21 30.86,29.21 26.58,24.93
  other vias: 5.49,39.4 14.91,24.8
ANTPW1  (via drill 0.3)
  Top 0.254: Q4.3 5.59,46.18 5.59,48.77 5.71,48.89 8.26,48.89 8.26,51.31 9.14,52.2 C65.2
  Bottom 0.254: L11.1 7.75,54.23 8.89,54.23 9.92,53.2 C65.2
  other vias: 9.92,52.2
D0
  Bottom 0.254: U3.42 49.45,14.61 40.16,14.61 P2.38
D1
  Bottom 0.254: U3.43 49.65,15.11 42.2,15.11 P2.36
D2
  Bottom 0.254: U3.44 49.85,15.62 44.23,15.62 P2.34
D3
  Bottom 0.254: U3.45 50.05,16.13 46.26,16.13 P2.32
D4
  Bottom 0.254: U3.46 50.24,16.64 48.29,16.64 P2.30
D5
  Bottom 0.254: U3.47 52.54,15.03 50.16,17.4 50.07,17.4 P2.28
D6
  Bottom 0.254: P2.26 52.19,16.1 U3.48
D7
  Bottom 0.254: U3.51 55.12,15.32 55.12,17.4 54.73,17.78 P2.24
D8
  Bottom 0.254: U3.52 57.27,16.77 P2.22
D9
  Bottom 0.254: U3.53 59.03,17.81 P2.20
D10
  Bottom 0.254: P2.18 61.18,16.64 58.55,16.64 U3.54
D11
  Bottom 0.254: P2.16 63.21,16.13 58.8,16.13 55.93,13.26 U3.55
D12
  Bottom 0.254: P2.14 65.24,15.62 59.18,15.62 | 59.18,15.62 59.05,15.62 | U3.56 58.96,15.62 59.18,15.62
D13
  Bottom 0.254: P2.12 67.27,15.11 59.18,15.11 56.62,12.55 U3.57
D14
  Bottom 0.254: P2.10 69.31,14.61 59.39,14.63 56.98,12.22 U3.58
D15
  Bottom 0.254: U3.59 57.31,11.84 57.47,12 59.56,14.1 71.25,14.1 74.96,17.81 P2.8
GND  (via drill 0.3, 1)
  Top 0.254: 88.01,12.25 P8.2 | C49.1 | 50.74,2.03 C22.2 | 60.6,4.8 60.45,4.83 | 58.37,8.13 C52.1 57.58,9.48 v57.63,9.65 | 50.72,1.93 50.61,1.97 50.48,2.03 | 50.48,2.03 C22.2 | C50.1 45.96,8.25 46.1,8.38 | v2.05,7.24 J1.GND@1 1.79,7.13 | 20.95,17.78 v20.95,17.91 P3.2 v20.95,19.81 | 88.67,3.08 P9.2 | 88.67,3.08 88.65,3.05 | P2.37 37.08,20.48 37.08,21.46 37.59,21.97 41.66,21.97 42.03,21.59 P2.33 42.03,20.32 | P7.1 1.17,40.51 DL1.C v1,39 v1.02,38.99 | 1.05,30.19 DL3.C v1.02,28.83 | 1.01,35.06 DL2.C v1.02,33.91 | 21.21,64.26 20.95,64.52 | P6.2 20.11,64.22 20.07,64.26 | 19.43,52.09 C71.2 | v87.88,3.17 87.86,3.18 P9.2 | v89.41,3.17 88.7,3.05 88.67,3.08 | P9.2 | P5.2 88.67,7.61 | P8.2 88.67,12.19 v89.41,12.19 | v87.92,12.23 87.88,12.19 | P8.2 89.66,12.97 | C14.1 60.55,4.92 60.71,4.83 | 50.48,2.03 v50.47,1.96 50.47,2.05 C22.2 | v47.62,5.33 v47.62,5.32 | C50.1 46.69,7.94 46.69,5.97 47.33,5.32 C8.2 | C63.1 47.03,13.32 47.19,13.34 | C50.1 46.34,8.26 v46.34,8.25 | DL4.C 1.02,23.88 v1.02,23.75 | C61.2 v29.84,41.6 | C45.1 C72.2
  Top 0.305: 46.23,8.25 46.1,8.38 | v47.64,5.32 v47.62,5.32 C8.2 | P6.2 21.17,64.22 21.21,64.26
  Top 0.5: 83.57,40.18 U1.4 | C1.2 82.22,28.91 82.17,28.96 | v84.46,39.88 v84.46,39.89 84.25,40.1 83.57,40.1 | U1.4 82.98,40.1 v82.77,39.88 | 83.57,40.1 U1.4 | C1.2 v82.3,28.96 | 84.64,28.96 C4.2 | 84.64,28.96 v84.58,28.96 | C1.2 83.44,28.87 | 83.44,28.87 84.55,28.87 84.64,28.96 | 83.44,28.87 83.44,31.24 | 83.44,31.24 83.44,33.86 U1.2 83.52,33.93 83.52,40.05 83.57,40.1 | 83.44,31.24 82.59,31.24 82.55,31.2 | 83.44,31.24 84.44,31.24 C3.2 | v87.88,3.17 v87.89,3.18 P9.2 v89.41,3.18 v89.41,3.17 | v88.01,7.62 88.03,7.6 P5.2 88.69,7.62 v89.41,7.62 | v87.92,12.23 P8.2 89.37,12.23 v89.41,12.19 | U4.4 U4.2 26.04,40.77 28.07,40.77 | 28.07,40.77 29.97,40.77 | 29.97,40.77 29.88,40.36 C61.2 | C58.2 29.97,40.06 29.97,40.77 | C59.2 28.07,40.77 | C60.2 28.07,41.43 28.07,40.77
  Top 0.508: 82.55,31.2 C2.2 | P2.6 P2.5 | P1.39 P1.40 | 29.84,40.06 C58.2 | C59.2
  Bottom 0.254: C38.1 80.41,3.32 81.03,3.94 U6.8 81.03,6.1 80.63,6.49 C32.1 | U3.50 53.34,14.25 v53.34,14.1 | 5.71,5.44 DD1.1 | 1.91,7.11 1.89,7.13 J1.GND@1 v2.05,7.24 | J1.GND@2 2.01,12.32 | 18.29,8.22 U2.8 18.47,8.04 v19.56,8.04 | 21.76,8.38 R48.1 | v19.43,13.08 19.05,13.08 18.8,12.83 18.25,12.83 U2.1 18.23,12.83 | C7.2 11.05,15.75 | U5.EXP 15.62,58.29 U5.16 16.64,58.29 16.38,58.55 | DD2.2 DD2.1 | 3.05,62.99 2.79,62.74 | 1.91,62.74 1.89,62.75 J2.GND@3 | J2.GND@3 2.03,62.99 | J2.GND@3 1.27,63 | C68.2 20.32,55.37 | 78.6,6.48 78.61,6.48 | 73.41,8.38 73.43,8.36 T2.4 | C41.1 | v59.82,12.61 59.48,12.61 U3.61 56.4,9.52 53.34,9.52 | 46.38,8.38 v46.34,8.25 46.48,8.38 47.47,8.38 U3.31 48.74,9.65 52.54,9.65 v52.66,9.77 | U3.2 57.81,9.78 57.53,9.78 v57.63,9.65 | C51.1 52.48,3.02 52.07,3.43 52.07,3.79 U3.18 53.34,5.06 53.34,5.33 | C23.1 v66.93,6.86 | C68.2 C29.1 | C46.2 C70.2 | C47.2 C48.2 | C65.1 12.81,52.2 C69.2 | C31.1 21.86,55.27 C30.1 20.45,55.39 C68.2 | C39.2 22.1,61.35 C40.1 | U2.15 11.66,12.17 11.3,11.81 v11.3,11.09 | C56.2 v8.38,14.61 | 53.34,9.52 53.34,5.33 | 53.34,9.52 U3.EXP | U3.14 53.77,5.33 53.34,5.33 | 54.68,6.55 U3.11 | 54.68,6.55 52.66,8.57 v52.66,9.77 | U3.10 55.39,6.55 54.68,6.55 | U3.7 54.29,9.77 v52.66,9.77 | U3.4 56.41,9.77 v52.66,9.77
  Bottom 0.5: C32.1 78.6,6.48 | C37.1 v75.44,11.18
  other vias: 42.55,2.03 40.01,2.03 37.47,2.03 34.93,2.03 32.39,2.03 29.84,2.03 27.3,2.03 24.76,2.03 22.22,2.03 19.68,2.03 17.14,2.03 14.61,2.03 12.06,2.03 9.53,2.03 6.99,2.03 4.45,2.03 1.91,2.03 42.55,9.65 42.55,12.19 40.01,12.19 37.47,12.19 34.93,12.19 32.39,12.19 29.84,12.19 27.3,12.19 24.76,4.57 24.76,7.11 24.76,9.65 24.76,12.19 24.76,14.73 24.76,17.27 24.76,19.81 17.14,19.81 14.61,19.81 12.06,19.81 9.53,19.81 4.45,19.81 1.91,19.81 1.91,17.27 1.91,14.73 1.91,4.57 27.3,50.29 24.76,50.29 22.22,50.29 19.68,50.29 17.14,50.29 34.93,50.29 29.84,50.29 14.61,50.29 9.53,50.29 6.99,50.29 4.45,50.29 1.91,50.29 34.93,52.83 34.93,55.37 34.93,65.53 34.93,68.07 32.39,68.07 29.84,68.07 27.3,68.07 24.76,68.07 22.22,68.07 19.68,68.07 17.14,68.07 14.61,68.07 12.06,68.07 9.53,68.07 6.99,68.07 4.45,68.07 1.91,68.07 1.91,65.53 81.07,39.88 86.17,39.88 81.07,41.71 82.77,41.71 84.47,41.71 86.17,41.71 79.37,39.88 79.37,41.71 87.87,39.88 87.87,41.71 79.37,43.41 81.07,43.41 82.77,43.41 84.47,43.41 86.17,43.41 87.87,43.41 79.37,38.18 81.07,38.18 82.77,38.18 84.47,38.18 86.17,38.18 87.87,38.18 85.34,17.27 85.34,19.81 85.34,22.35 85.34,24.89 88.27,17.27 88.27,19.81 88.27,22.35 88.27,24.89 75.56,24.89 73.02,24.89 70.48,24.89 88.27,14.73 81.79,8 85.22,9.65 78.1,2.03 75.56,2.03 73.02,2.03 70.48,2.03 67.94,2.03 85.22,5.33 78.61,10.16 73.79,12.57 76.96,14.48 76.2,7.24 73.79,11.18 75.95,13.46 66.93,16 69.34,16 71.88,16 71.25,19.05 68.71,19.05 66.17,19.05 61.09,19.05 65.41,12.19 67.94,12.19 70.48,12.19 65.41,8.89 62.87,7.11 61.34,9.52 44.78,16.38 42.24,16.38 39.7,16.38 37.29,16.38 34.49,16.38 40.72,19.05 43.26,19.05 45.8,19.05 48.46,19.05 51,19.05 32.46,16.38 30.56,16.38 28.52,16.38 32.46,18.54 32.46,20.96 33.86,22.35 35.13,23.62 44.36,2.14 47.2,13.32 52.62,3.02 50.8,8 60.7,4.92 73.42,8.36 82.42,14.34 83.49,33.9 82.5,31.16 84.49,31.2 38.94,9.78 36.27,9.78 32.84,9.78 29.41,9.78 28.07,10.65 30.86,10.65 34.8,10.65 37.72,10.65 40.26,10.65 35.83,4.06 27.38,4.57 29.92,4.57 21.72,8.42 19.56,5.25 21.72,5.25 15.49,8.04 12.7,7.15 19.43,10.92 18.41,15.84 23.44,21.08 18.49,21.08 15.95,21.08 13.41,21.08 10.74,21.08 7.46,21.08 7.44,19.81 20.9,21.08 3.71,16.95 2.06,12.36 5.63,5.53 8.26,3.85 10.58,4.32 16.88,4.19 20.9,22.86 23.44,22.86 26.11,22.86 26.11,21.08 28.78,22.48 30.68,24.38 32.33,26.16 65.41,26.16 62.87,26.16 60.33,26.16 57.79,26.16 55.12,26.16 52.71,26.16 50.16,26.16 47.62,26.16 45.09,26.16 34.87,26.16 37.54,26.16 39.95,26.16 42.49,26.16 30.68,35.05 42.49,31.12 40.08,31.12 37.41,31.12 34.87,31.12 32.21,31.12 30.05,31.12 28.52,29.46 8.33,29.97 26.75,29.46 24.71,29.46 22.94,29.46 20.9,29.46 22.78,28.2 16.46,32.13 24.71,32.51 26.62,32.51 27.37,36.71 28.87,36.54 8.33,27.43 8.33,24.89 8.2,35.05 8.2,37.72 1.85,45.21 1.85,47.75 4.39,47.75 7.06,47.75 9.47,47.75 9.47,45.21 14.92,40.39 17.72,42.21 17.72,39.21 17.72,40.71 17.72,43.71 19.22,36.96 19.22,38.46 20.72,38.46 20.72,36.96 19.22,43.71 20.72,43.71 16.22,43.71 16.22,42.21 16.22,40.71 16.22,39.21 19.73,40.89 25.92,40.89 28.04,41.46 28.06,40.19 29.91,40 31.57,37.59 31.57,40.13 31.57,42.67 31.57,45.21 31.57,47.75 28.65,45.21 27.33,47.13 25.87,47.36 31.57,50.29 14.68,47.75 17.22,47.75 1.85,52.83 1.85,55.37 2.06,57.92 2.06,63 4.52,65.53 7.06,65.53 6.01,54.04 6.01,52.14 11.67,52.2 14.1,53.48 19.07,52.32 20.43,57.15 21.97,55.39 21.86,53.97 25.02,55.39 31.06,52.96 26.11,52.96 28.67,53.03 27.13,62.48 28.58,63.98 31.06,55.37 31.06,57.78 31.06,60.45 31.06,62.99 31.06,65.41 28.65,65.41 25.48,65.41 23.62,64.88 21.17,64.22 17.77,61.98 22.1,61.58 23.62,59.83 15.92,64.85 12.88,65.49 7.87,62.47 11.32,62.48 20.43,55.37 10.05,56.13 10.05,58.17 10.05,59.69 8.89,11.09 8.38,8.42 6.6,12.48 6.48,15.91 8.38,15.91 11.06,15.75 78.61,6.49 49.48,9.89 50.24,10.65 51.01,11.42 51.77,12.18 52.53,12.94 50.37,9 51.13,9.77 51.9,10.53 52.66,11.29 53.42,12.05 52.02,7.35 52.78,8.11 53.55,8.88 54.31,9.64 55.07,10.4 54.18,11.29 53.42,10.53 51.9,9 55.96,9.51 55.2,8.75 54.44,7.99 55.96,7.99 56.72,8.75 54.31,12.94 55.07,12.18 55.96,11.29 56.85,10.4 14.43,59.42 15.32,59.42 16.21,59.42 14.43,58.53 15.32,58.53 16.21,58.53 14.43,57.64 15.32,57.64 16.21,57.64 41.06,65.41 46.06,65.41 56.06,65.41 51.06,65.41 61.06,65.41 66.06,65.41 71.06,65.41 76.06,65.41 81.06,65.41 86.06,65.41 91.06,65.41 96.06,65.41 41.06,55.4 41.06,50.4 41.06,45.4 34.92,35.4 51.06,35.4 56.06,35.4 61.06,35.4 66.06,35.4 71.06,35.4 76.06,35.4 76.06,40.4 71.06,40.4 66.06,40.4 61.06,40.4 56.06,40.4 51.06,40.4 46.06,40.4 46.06,45.4 46.06,50.4 46.06,55.4 51.06,55.4 51.06,50.4 51.06,45.4 56.06,45.4 56.06,50.4 56.06,55.4 61.06,55.4 61.06,50.4 61.06,45.4 66.06,45.4 66.06,50.4 66.06,55.4 71.06,55.4 71.06,50.4 71.06,45.4 76.06,45.4 76.06,50.4 76.06,55.4 81.06,55.4 81.06,50.4 81.06,45.4 86.06,45.4 86.06,50.4 86.06,55.4 86.06,60.4 91.06,55.4 96.06,55.4 96.06,50.4 91.06,50.4 91.06,45.4 96.06,45.4 96.06,40.4 91.06,40.4 91.06,35.4 96.06,35.4 96.06,30.41 91.06,30.41 76.06,35.4 76.06,30.41 76.06,30.41 71.06,30.41 66.06,30.41 96.06,25.41 91.06,25.41 96.06,14.77 90.81,14.77 91.06,10.41 91.06,5.41 96.06,5.41 96.06,10.41 34.92,37.56 34.92,40.1 34.92,42.64 34.92,45.18 34.92,47.72 51.06,30.41 61.06,30.41 56.06,30.41 91.12,60.4 90.8,17.27 90.8,19.81 90.8,22.35 91.06,2.1 96.02,2.1 4.9,55.37 4.9,57.91 37.46,35.4 40,35.4 9.47,42.93 14.7,42.21 14.7,43.74
  pour Bottom (isolate 0.305): -2.51,72.88 102.84,72.88 102.84,-2.51 -2.51,-2.51
  pour Top (isolate 0.305): -3.63,73.49 103.91,73.49 103.91,-3.51 -3.63,-3.51
GPIO17  (via drill 0.3)
  Top 0.254: 43.43,32.67 v43.43,32.64 43.43,21.49 P2.31
  Bottom 0.254: P7.4 4.32,32.89 4.95,32.26 14.1,32.26 14.1,30.73 28.07,30.73 29.59,32.64 42.16,32.64 42.17,32.64 v43.43,32.64
GPIO18  (via drill 0.3)
  Top 0.254: P2.29 46.36,21.11 v46.36,33.91 | R47.2 17.62,34.85 14.68,34.85 12.83,36.7 5.97,36.7 4.7,37.97 P7.2
  Bottom 0.254: v46.36,33.91 v46.35,33.91 45.72,33.91 45.47,34.16 42.8,34.16 42.55,33.91 29.08,33.91 27.43,31.75 17.91,31.75 17.62,32.04 R47.2
  other vias: 17.62,35.1
GPIO19  (via drill 0.3)
  Top 0.254: P2.27 49.65,20.83 49.15,21.34 v49.15,30.23
  Bottom 0.254: P7.6 5.47,25.78 25.84,25.83 26.09,25.83 | v49.15,30.23 30.48,30.23 26.09,25.83 | 26.09,25.83 26.09,26.72 26.3,26.94 R41.2
  other vias: 26.3,27.52
GPIO20  (via drill 0.3)
  Top 0.254: P2.25 53.5,19.05 58.55,19.05 58.55,16.93 v62.61,12.87
  Bottom 0.254: U3.63 59.08,10.8 59.44,10.8 59.82,10.41 61.34,10.41 61.34,12.95 61.62,12.95 62.52,12.95 v62.61,12.87
GPIO21  (via drill 0.25)
  Top 0.254: P2.23 54.74,20.45 53.85,21.34 v53.85,26.92
  Bottom 0.254: v53.85,26.92 53.85,27.18 31.88,27.18 26.67,21.97 3.95,21.97 P7.8 1.02,25.16 R4.1
GPIO22  (via drill 0.3)
  Top 0.254: v56.13,32 56.13,31.88 57.02,30.99 57.02,29.67 56.13,28.78 56.13,21.49 P2.21
  Bottom 0.254: P7.5 1.06,30.35 R3.1 | P7.5 3.44,30.21 | P7.5 3.55,30.35 4.83,31.62 13.59,31.62 13.59,30.23 28.32,30.23 29.72,32 42.8,32 43.05,31.75 43.82,31.75 44.07,32 v56.13,32
GPIO23  (via drill 0.3)
  Top 0.254: P2.19 59.81,20.45 59.05,21.21 v59.05,33.27
  Bottom 0.254: R2.1 3.4,35.47 3.4,35.43 P7.3 4.06,35.43 4.06,34.29 5.46,32.89 14.61,32.89 14.61,31.24 27.81,31.24 29.34,33.27 42.8,33.27 43.05,33.53 45.21,33.53 45.59,33.15 46.99,33.15 47.12,33.27 v59.05,33.27
GPIO24  (via drill 0.3)
  Top 0.254: P2.17 61.72,20.99 61.75,28.78 62.36,29.39 62.36,30.73 61.72,31.37 v61.72,34.54 | v32.2,35.05 32.64,35.05 32.64,51.31 v32.13,51.31
  Bottom 0.254: v61.72,34.54 46.99,34.54 46.61,34.92 42.8,34.92 42.42,34.54 32.71,34.54 v32.2,35.05 | R31.2 26.76,57.53 26.8,57.53 27.87,58.6 32.08,58.6 32.13,58.55 v32.13,51.31
GPIO25  (via drill 0.3)
  Top 0.254: P2.15 64.89,20.32 63.63,19.05 v63.63,13.21
  Bottom 0.254: U3.60 59.75,13.59 63.25,13.59 v63.63,13.21
GPIO26  (via drill 0.3)
  Top 0.254: v67.44,24.64 v67.43,24.64 P2.13 | v13.97,11.81 v15.49,11.81 | v23.49,16 v27.18,16
  Bottom 0.254: v23.49,16 22.73,16.76 15.37,16.76 15.11,16.51 15.11,13.21 15.49,12.83 v15.49,11.81 15.49,11.68 | v27.18,16 27.18,17.78 33.91,24.51 66.29,24.51 66.42,24.64 v67.44,24.64 | U2.14 13.68,11.52 v13.97,11.81
GPIO27  (via drill 0.3)
  Top 0.254: P2.11 69.47,20.86 v69.47,25.78 | v20.45,13.46 v26.29,13.46
  Bottom 0.254: U2.2 18.27,12.19 20.45,12.19 v20.45,13.46 | v26.29,13.46 26.29,18.03 33.53,25.27 66.67,25.27 67.18,25.78 v69.47,25.78
GPIO28
  Bottom 0.254: P2.9 73.82,19.05 75.44,19.05 76.33,18.16 76.33,17.14 74.04,14.86 72.77,14.86 71.37,13.46 71.37,4.7 70.87,4.19 70.23,4.19 69.6,3.56 66.93,3.56 66.42,3.05 65.02,3.05 64.26,2.16 52.2,2.16 51.44,2.92 51.44,3.86 U3.19
GPIO29
  Bottom 0.254: P2.7 76.36,19.05 78.61,19.05 78.87,18.8 78.87,17.02 78.23,16.38 76.45,16.38 74.42,14.35 73.02,14.35 71.88,13.21 71.88,4.06 71.37,3.56 70.61,3.56 69.98,2.92 67.31,2.92 66.8,2.41 65.41,2.41 64.77,1.65 51.94,1.65 50.93,2.67 50.93,4.06 U3.20
N$1  (via drill 0.3)
  Top 0.254: DL1.A R1.2
  Bottom 0.254: R1.2 1,42.26 1,42.29
  other vias: 1.02,42.25
N$2
  Top 0.508: Q1.3 18.69,34.31 18.41,34.04 13.08,34.04 C33.C+
N$3
  Top 0.254: Q1.1 23.54,33.36 C26.2 23.9,33.3 25.02,34.42 26.33,34.42 DD3.3 26.75,34.84 R40.2
N$4  (via drill 0.3)
  Top 0.254: R2.2 DL2.A
  other vias: 1.02,37.17
N$5  (via drill 0.3)
  Top 0.254: R3.2 DL3.A
  other vias: 1.02,32.09
N$6  (via drill 0.3)
  Top 0.254: 0.6,27.01 DL4.A R4.2
  other vias: 1.02,27.01
N$7
  Bottom 0.254: R5.1 59.01,11.43 U3.62
N$8  (via drill 0.3)
  Top 0.254: C20.2 63.03,4.1 62.99,4.06 v62.87,4.06
  Bottom 0.254: R27.2 66.93,5.29 66.93,4.19 | 66.93,4.19 69.21,4.19 70.35,5.32 T2.3 | R23.2 v62.87,4.06 62.87,3.43 55.5,3.43 55.12,3.81 55.12,4.69 U3.13 | C20.2 65.57,4.19 66.93,4.19
  other vias: 65.48,4.1
N$9
  Top 0.5: U1.1 81.17,32.53 80.77,32.13 80.77,31.17 C2.1 80.75,30.46 80.26,29.97 80.26,28.91 C1.1
  Top 0.508: 81.03,33.75 U1.1 | FL1.2 80.22,27.11 C1.1
N$10
  Bottom 0.254: T2.2 C23.2 | C23.2 68.69,5.36 R27.1 | C23.2 68.69,8.36 R26.2
N$11  (via drill 0.3)
  Top 0.254: C20.1 62.88,5.85 62.87,5.84 62.9,5.84 R23.1
  Bottom 0.254: T2.1 69.18,9.52 67.06,9.52 66.97,9.44 R26.1 66.42,8.38 65.48,7.44 C20.1 | R23.1 61.85,5.8 61.85,3.96 55.75,3.96 55.63,4.09 55.63,4.88 55.18,5.32 U3.12
  other vias: 65.48,5.85 62.87,5.8
N$12
  Bottom 0.254: C34.1 73.44,5.08 T2.6
N$13
  Bottom 0.254: C34.2 79.73,5.08 U6.10
N$14  (via drill 0.3)
  Bottom 0.254: 77.18,11.07 C37.2 | C37.2 77.2,13.57 77.89,14.26 Y1.1 | U6.2 80.52,9.61 80.52,10.54 80.12,10.94 | 80.12,10.94 C66.2 | C37.2 77.44,10.94 80.12,10.94
  other vias: 80.05,10.94
N$15
  Top 0.254: 84.53,3.22 P9.1 82.3,3.18 C67.2
N$16
  Top 0.254: P8.1 83.23,12.23 82.8,11.81 81.91,11.81 81.91,11.06 C66.1
N$17
  Bottom 0.254: C38.2 81.53,3.86 U6.7 81.53,6.61 80.01,8.13 80.01,9.59 U6.1 79.69,9.27 78.61,9.27 | 78.61,9.27 FL3.1 | C32.2 78.61,9.27
N$18  (via drill 0.3)
  Top 0.254: C67.1 80.26,3.41 v80.26,4.27
  Bottom 0.254: v80.26,4.27 80.52,4.53 80.52,4.57 80.53,4.58 U6.9
N$19  (via drill 0.3)
  Bottom 0.254: U6.6 82.03,6.71 82.93,7.62 84.58,7.62 84.59,7.61 P5.1
  other vias: 85.2,7.61
N$20  (via drill 0.3)
  Top 0.254: 55.88,4.57 R20.2 57.29,4.45 v57.53,4.68
  Bottom 0.254: U3.9 56.77,5.87 56.77,4.7 56.79,4.68 v57.53,4.68
N$21  (via drill 0.3)
  Top 0.254: v57.53,6.22 55.97,6.22 R18.2
  Bottom 0.254: U3.8 57,6.35 57.4,6.35 v57.53,6.22
N$22
  Bottom 0.254: U6.3 81.12,9.7 81.12,11.08 81.15,11.12 81.15,12.57 81.17,12.59 81.53,12.59 | 81.53,12.59 C41.2 | 81.53,12.59 80.8,12.59 Y1.3
N$23
  Top 0.254: 51.21,6.22 50.92,6.24 C13.2 49.46,7.59 R21.2 48.36,7.97 47.85,7.46 47.85,6.84 R17.2 | R18.1 54.2,6.22 C19.1 52.66,6.24 50.78,6.24
  Top 0.305: 50.42,6.6 50.78,6.24 50.92,6.24
N$24  (via drill 0.3)
  Top 0.254: 49.17,5.31 49.17,5.05 R22.2 49.14,4.44 48.9,4.19 47.18,4.19 C8.1 44.39,5.32 44.39,3.93 C9.1 | 49.17,5.31 R21.1 | 49.17,5.31 49.19,5.32 55.79,5.34 56.62,5.34 56.77,5.46 58.43,5.46 58.56,5.33 59.31,5.33 60.55,6.57 60.55,6.69 | v60.07,8 60.2,7.75 60.2,6.92 60.55,6.69 | 60.55,6.69 C14.2
  Bottom 0.254: T1.2 43.56,5.71 43.94,5.33 45.78,5.33 C8.1 | U3.3 58.75,8.13 59.82,8.13 v60.07,8
  other vias: 45.79,5.32
N$25
  Top 0.254: 52.68,4.45 52.65,4.07 | 52.68,4.45 C19.2 | C19.2 52.65,4.34 | R20.1 52.69,4.45 52.68,4.45 | C19.2 52.91,4.45 | C19.2 52.65,4.45 | R24.2 49,3.08 R22.1 49.63,3.43 50.04,3.43 50.42,3.81 C22.1 51.14,4.47 C19.2
N$26  (via drill 0.3)
  Bottom 0.254: T1.1 43.85,3.05 45.81,3.05 R24.1
  other vias: 45.84,3.08
N$27  (via drill 0.3)
  Bottom 0.254: T1.3 45.41,7.21 R17.1
  other vias: 45.83,6.8
N$28
  Bottom 0.254: C25.1 40.65,9.16 40.64,7.24 40.64,4.23 T1.4 37.86,4.22 C24.1 36.82,4.95 34.93,4.95 34.12,4.15 R25.1
N$29
  Bottom 0.254: T1.6 38.11,7.21 37.61,7.38 | 37.61,7.38 L4.2 37.7,9.14 C18.1 | C12.2 37.61,6 37.61,7.38
N$30
  Bottom 0.254: C12.1 35.83,7.42 L4.1 34.8,7.49 | 34.8,7.49 L3.2 33.64,7.37 C11.2 | C17.1 34.8,7.49
N$32
  Bottom 0.254: C11.1 31.89,7.37 L3.1 30.86,7.49 | C16.1 30.86,7.49 | 29.84,7.49 30.86,7.49 | 29.84,7.49 L2.2 | C10.2 29.7,7.35 29.84,7.49
N$34  (via drill 0.3)
  Top 0.254: v23.75,8.25 26.04,8.25 v26.04,8
  Bottom 0.254: C15.1 28.07,7.73 L2.1 | L2.1 27.96,7.62 C10.1 | L2.1 27.57,7.75 26.04,7.75 v26.04,8 | U2.7 20.67,8.92 20.7,8.89 20.7,7.37 20.83,7.24 22.48,7.24 23.37,8.13 23.62,8.13 v23.75,8.25
N$35
  Top 0.508: C62.C+ 16.97,45.12 Q6.3
N$36
  Top 0.254: R41.1 24.64,27.48 23.25,26.1 Q3.1
N$37
  Top 0.254: R39.1 19.74,28.52 20.45,27.81
  Top 0.305: 20.45,27.81 20.45,27.06 Q3.3
N$38
  Top 0.254: Q2.1 18.53,25.32 R38.1 18.53,27.01 R39.2
N$39
  Top 0.508: FL4.2 23.88,37.98 24.48,38.57 U4.1 27.93,38.57 C59.1 28.61,38.44 29.21,37.85 29.76,37.85 C58.1
N$40
  Top 0.508: R50.2 25.19,45.43 DD4.3 22.64,45.16 C57.2 Q6.1
N$41
  Top 0.254: R9.1 R7.1 R6.1 15.39,26.5 Q2.2
N$42
  Bottom 0.254: U5.5 12.18,59.31 C48.1
N$43
  Bottom 0.254: 13.04,64.22 R34.1 | R36.1 10.5,63.37 12.19,63.37 13.04,64.22 | 13.04,64.22 13.07,64.2 C45.2 13.08,62.48 13.46,62.1 13.46,61.09 U5.7
N$44
  Top 0.254: 14.93,37.84 Q5.1 16.41,36.8 R47.1 17.71,36.45
N$45
  Top 0.254: R46.1 12.43,41.6 Q5.3
N$46
  Top 0.254: R46.2 10.79,41.15 R45.1 9.6,42.16 7.11,42.16 7.11,44.86 3.96,44.86 3.87,44.76 Q4.1 3.94,44.1 3.94,43.69
N$47
  Top 0.254: 6.35,41.1 R44.1 5.59,41.39 | 6.35,41.1 7.3,41.1 R42.1 8.36,41.14 R43.1 | Q4.2 5.97,41.48 6.35,41.1
N$48
  Bottom 0.254: U5.4 12.43,58.8 C47.1
N$49  (via drill 0.3)
  Top 0.254: C21.1 29.97,59.63 29.97,60.32 29.31,60.99 T3.6
  other vias: 28.58,60.99
N$50
  Top 0.254: 28.94,56.77 P4.1 29.2,56.5 29.84,57.15 29.84,57.75 C21.2
N$51
  Bottom 0.254: 23.89,63.26 C42.2 | 23.89,63.26 23.24,62.61 20.7,62.61 20.66,62.57 R33.2 | T3.1 24.61,63.98 23.89,63.26
N$52
  Bottom 0.254: R32.2 20.65,59.83 C39.1 22.1,59.44 22.73,58.8 24.38,58.8 24.76,59.18 24.76,60.96 24.79,60.98 T3.3
N$53
  Bottom 0.254: C40.2 24.27,62.23 24.89,62.23 25.15,62.48 T3.2 25.65,62.48 26.42,61.72 26.42,59.94 26.54,59.82 28.41,59.82 R29.1
N$54
  Bottom 0.254: 21.72,10.16 R51.1 | 21.72,10.16 R48.2 | U2.6 20.7,9.57 20.7,10.16 21.72,10.16
N$55
  Bottom 0.254: U5.12 16.64,60.71 16.89,60.96 18.96,60.96 R33.1
N$56
  Top 0.254: 15.9,63.14 C44.2 16.06,63.5 17.02,63.5 17.69,64.18 P6.1 17.74,64.22
N$57  (via drill 0.25)
  Top 0.254: C44.1 14.2,64.12 C55.2
  Bottom 0.254: U5.8 14.61,61.34 14.2,61.62 C44.1
  other vias: 14.2,63.39
N$58
  Bottom 0.254: U5.6 12.83,60.45 12.83,61.47 9.53,61.47 | R37.1 6.22,61.85 6.6,61.47 9.53,61.47 | 9.53,61.47 9.65,61.47 9.65,62.47 C46.1 9.64,62.5 8.76,63.37 8.76,65.41 9.02,65.66 R35.1
N$59  (via drill 0.3)
  Top 0.254: P3.1 v20.95,15.24
  Bottom 0.254: R49.2 19.84,14.14 v20.95,15.24 21.68,14.51 21.72,14.51 R51.2
N$60
  Bottom 0.254: U5.13 17.4,59.94 R32.1
N$61
  Bottom 0.254: U5.14 17.78,59.31 18.16,58.93 21.72,58.93 22.48,58.17 24.51,58.17 24.57,58.1 | 25.17,56.98 C35.1 | 24.57,58.1 25.02,57.66 C35.1 | C35.1 25.04,57.11 | R31.1 25.36,58.89 24.57,58.1
N$62
  Bottom 0.254: U5.15 17.65,58.8 18.03,58.42 21.34,58.42 21.97,57.78 21.97,57.15 | 21.97,57.15 C30.2 | R30.1 23.46,57.15 21.97,57.15
N$63
  Bottom 0.254: C31.2 23.61,55.3 R30.2
N$64  (via drill 0.3)
  Top 0.254: L9.2 5.39,16.88 C27.2 6.6,18.09 v6.6,22.86
  Bottom 0.254: 17.48,22.73 Q2.3 17.45,22.79 17.4,22.73 6.73,22.73 v6.6,22.86 | L9.2 C27.2 | C27.2
  other vias: 5.46,16.95 17.53,22.79
N$65
  Bottom 0.254: U5.17 17.92,57.78 C29.2
N$66
  Bottom 0.254: U2.9 12.57,8.18 | 8.13,6.45 8.16,6.48 | 8,6.48 8.16,6.48 | 12.45,8.22 U2.9 | DD1.3 8,6.48 | 8.16,6.48 10.7,6.48 U2.9 | C5.2 7.23,7.25 8,6.48
N$68
  Bottom 0.254: L8.2 L9.1
N$69
  Bottom 0.254: U5.22 15.11,52.58 15.49,52.2 L6.2
N$70
  Bottom 0.254: U5.20 16.13,56.26 16.89,55.5 16.89,52.2 L6.1
N$71
  Bottom 0.254: 15.63,56.63 U5.21 15.62,54.36 16,53.97 L5.2
N$72
  Bottom 0.254: 16.64,56.52 U5.19 17.77,55.51 L5.1
N$73
  Bottom 0.254: L7.2 12.83,54.62 12.83,55.63 13.84,56.64 U5.24
N$74
  Bottom 0.254: C43.2 10.02,54.23 L7.1
N$75
  Bottom 0.254: C53.2 6.22,56.27 C43.1 7.11,55.39 7.11,53.85 7.87,53.09 DD2.3
N$76  (via drill 0.3)
  Bottom 0.254: L8.1 5.46,9.67 C5.1 2.05,9.65 J1.P
  other vias: 2.06,9.82
N$78  (via drill 0.3)
  Bottom 0.254: 5.83,59.31 C53.1 | 6.21,58.93 C53.1 | L11.2 C53.1 | C53.1 5.6,58.91 4.05,60.46 J2.P
  other vias: 2.06,60.46
N$79
  Bottom 0.254: R12.2 R13.2 14.26,13.42 14.35,13.34 14.35,13.08 14.73,12.7 14.73,10.87 U2.13
N$80  (via drill 0.3)
  Top 0.5: 23.49,48.77 23.49,51.96 23.51,51.94 FL2.1
  Top 0.508: U4.3 28.02,43.2 C60.1 28.61,43.21 29.08,43.69 29.82,43.69 | 29.82,43.69 C61.1 | Q6.2 22.12,47.43 C57.1 23.89,47.29 DD4.2 24,47.4 24,48.77 | 24,48.77 29.84,48.77 29.84,43.71 29.82,43.69 | 24,48.77 23.49,48.77
  other vias: 24.24,51.94
N$81
  Bottom 0.254: 15.96,14.14 R13.1 | 18.2,11.56 U2.3 16.68,11.52 16.26,11.94 16.26,12.95 15.96,13.25 R13.1 | R14.2 R13.1
N$82
  Bottom 0.254: 14.99,5.93 R16.2 15.03,6.22 14.86,6.06 R15.2 13.97,6.31 13.97,9.52 12.53,9.52 U2.11
N$83
  Bottom 0.254: U2.5 17.07,10.22 16.85,9.99 R16.1 18.25,6.22 R19.2
N$84
  Bottom 0.254: U2.4 18.5,10.87 18.13,10.87 17.55,10.87 15.49,10.87 15.5,10.22 U2.12
N$85
  Bottom 0.254: 10.68,8.15 R11.2 10.96,8.17 11.68,8.89 12.47,8.89 U2.10
PCLK
  Bottom 0.254: U3.41 50.44,12.93 49.28,14.1 38.48,14.1 35.56,17.02 35.56,18.16 36.45,19.05 38.19,19.05 P2.35
SCL  (via drill 0.3)
  Top 0.254: P2.40 31.62,20.61 31.62,21.59 32.13,22.1 32.13,24.51 33.15,25.53 v33.15,51.91
  Bottom 0.254: P2.40 34.54,17.94 34.54,18.67 35.56,19.69 35.56,20.96 37.59,22.99 80.9,22.99 81.41,22.48 81.41,17.14 83.57,14.99 83.57,11.3 83.18,10.92 81.79,10.92 81.53,10.66 U6.4 | R35.2 11.56,65.66 11.56,66.17 31.62,66.17 32.64,65.02 32.64,52.42 v33.15,51.91
SDA  (via drill 0.3)
  Top 0.254: P2.39 32.77,22 32.77,24 33.66,24.89 33.66,51.43 v34.03,51.43
  Bottom 0.254: P2.39 34.42,20.96 37.21,23.75 83.06,23.75 84.07,22.73 84.07,11.05 83.44,10.41 82.83,10.41 U6.5 | R34.2 10.92,64.26 10.54,64.64 10.54,66.68 32,66.68 33.15,65.41 33.15,52.96 34.04,52.07 v34.04,51.43 v34.03,51.43
VCT  (via drill 0.25, 0.3)
  Top 0.254: 14.1,55.24 C28.2 | C68.1 18.54,55.37 18.4,55.23 C28.2 | C73.1 15.88,61.98 15.24,61.34 11.91,61.34 11.42,60.85 | C54.1 12.7,55.23 C28.2 | 11.42,60.85 v11.3,60.74 | C72.1 11.42,60.83 11.42,60.85 | C70.1 7.86,60.71 v7.86,60.72
  Top 0.5: FL2.2 21.45,51.94 C71.1
  Bottom 0.254: 11.8,56.39 C54.1 | 11.8,56.39 11.8,56.53 11.18,57.15 9.14,57.15 9.14,60.83 | 9.14,60.83 10.41,60.83 10.51,60.74 v11.3,60.74 | U5.2 12.72,57.78 12.7,57.76 12.7,57.02 12.06,56.39 11.8,56.39 | R37.2 6.18,64.14 5.71,64.14 5.21,63.63 5.21,61.59 5.97,60.83 7.87,60.83 | 7.87,60.83 9.14,60.83 | 6.52,64.39 R37.2 | R37.2 7.75,64.1 R36.2 | U5.11 16.13,61.85 16,61.98 C73.1 | U5.18 17.27,56.9 18.68,55.48 C68.1 | FL2.2 22.22,51.96 22.22,52.96 24.64,52.96 24.64,54.36 25.91,54.36 25.91,56.26 27.56,56.26 27.56,56.9 28.49,57.82 R29.2 | 7.87,60.59 v7.86,60.72 7.87,60.61 7.87,60.83 | U5.23 14.61,55.74 C28.2
  Bottom 0.5: FL2.2 | 20.7,51.95 22.22,51.95 22.22,51.96
  Bottom 0.508: C68.1 18.68,54.47 18.92,54.23 20.7,54.23 20.7,51.95
  other vias: 16.02,61.98 11.8,56.13 14.1,55.23 18.68,55.37 22.24,51.94
VDD  (via drill 0.3)
  Top 0.254: C64.2 5.71,21.46 | C64.2 5.71,24.26 4.83,25.15 3.31,25.15 P7.7 | v53.34,16.89 53.37,16.87 C49.2 | v5.59,18.29 5.71,18.41 C64.2 | v11.18,12.83 8.89,12.83 8.88,12.84 C56.1
  Top 0.5: U1.3 86.24,33.46 C3.1 86.23,30.48 86.7,30.01 C4.1 | v81.66,15.62 81.79,15.49 v84.96,15.49 | 57.03,15.83 58.21,15.83 62.19,11.85 R5.2 | v70.61,10.16 72.26,10.16 72.64,9.78 v72.77,9.78 | 49.66,13.72 v49.02,13.08
  Top 0.508: C3.1 86.22,31.2 C3.1 | 57.03,15.83 C49.2 51.77,15.83 49.66,13.72
  Bottom 0.254: U3.5 57.65,7.75 58.36,7.05 | 58.36,7.05 58.42,6.99 58.78,6.98 | U3.6 57.71,7.05 58.36,7.05 | U3.1 59.41,8.89 60.71,8.89 61.09,8.51 | DD1.2 5.63,7.66 6.35,8.38 6.35,10.54 8.38,12.57 C56.1 7.37,12.84 7.37,17.27 | 12.48,12.83 U2.16 11.31,12.82 11.3,12.83 v11.18,12.83 | R10.2 7.37,17.27 | 7.37,17.27 7.37,18.29 v5.59,18.29 | U3.49 54.23,15.84 54.23,16.38 53.72,16.89 v53.34,16.89 | U3.15 54.14,4.28 54.48,3.94 54.48,3.43 | 54.48,3.43 54.48,2.94 54.47,2.92 | U3.16 54.26,3.43 54.48,3.43 | U3.17 53.82,3.02 C51.2 | U3.32 47.15,9.23 C50.2
  Bottom 0.5: 86.74,28.07 86.7,28.11 C4.1 | 79.5,15.62 v81.66,15.62 | R5.2 62.61,11.01 62.61,10.16 62.61,9.4 61.98,8.51 61.09,8.51 | 69.21,10.16 v70.61,10.16 | 60.9,7.05 61.09,7.24 | 54.47,2.92 C51.2 54.59,2.79 55.75,2.79 | v49.02,13.08 47.51,11.57 | 47.51,11.57 C63.2 | 47.51,11.57 46.36,10.41 46.36,10.29 46.35,10.28 C50.2 | 58.78,6.98 C52.2
  Bottom 0.508: v84.96,15.49 86.74,15.49 86.74,28.07 31.5,28.07 27.17,23.74 4.97,23.74 P7.7 3.44,25.02 | 79.5,15.62 76.83,15.62 74.93,13.72 73.41,13.72 72.52,12.83 72.52,10.03 v72.77,9.78 74.3,9.78 74.8,9.27 FL3.2 | 62.1,11.72 R5.2 62.42,11.58 | 55.75,2.79 63.63,2.79 64.26,3.56 64.26,10.11 64.31,10.16 | 58.36,7.05 60.9,7.05 | 61.09,8.51 61.09,7.24 | 64.31,10.16 69.21,10.16 | 62.61,10.16 64.31,10.16
  other vias: 86.7,28.89 62.19,11.43 54.37,3.02 47.2,11.57 46.35,10.02 58.78,6.53 8.38,12.84
VREF  (via drill 0.3)
  Top 0.254: v26.04,5.71 v23.75,5.71 | v9.14,5.71 v9.14,7.37
  Bottom 0.254: v26.04,5.71 26.04,4.06 26.42,3.68 31.41,3.68 R25.2 | 15.24,4.3 15.24,5.21 17.53,5.21 18.25,4.48 R19.1 18.33,4.45 22.73,4.45 22.73,4.7 v23.75,5.71 | 15.24,4.3 C6.1 | 15.24,4.3 15.19,4.36 R15.1 12.45,4.36 R8.1 12.28,5.12 11.68,5.71 v9.14,5.71 | 10.41,9.91 10.45,9.91 R11.1 | 10.41,9.91 10.41,14.1 R12.1 11.29,14.22 C7.1 | C7.1 R14.1 | C7.1 12.81,17.25 R10.1 | v9.14,7.37 9.14,7.49 9.53,7.87 9.53,9.91 10.41,9.91

### Text on the board
Top: BBRF103_2
Bottom: BBRF103_2